# EAGLE design 8 Cell Balancing Module(2) (EAGLE 5.12)
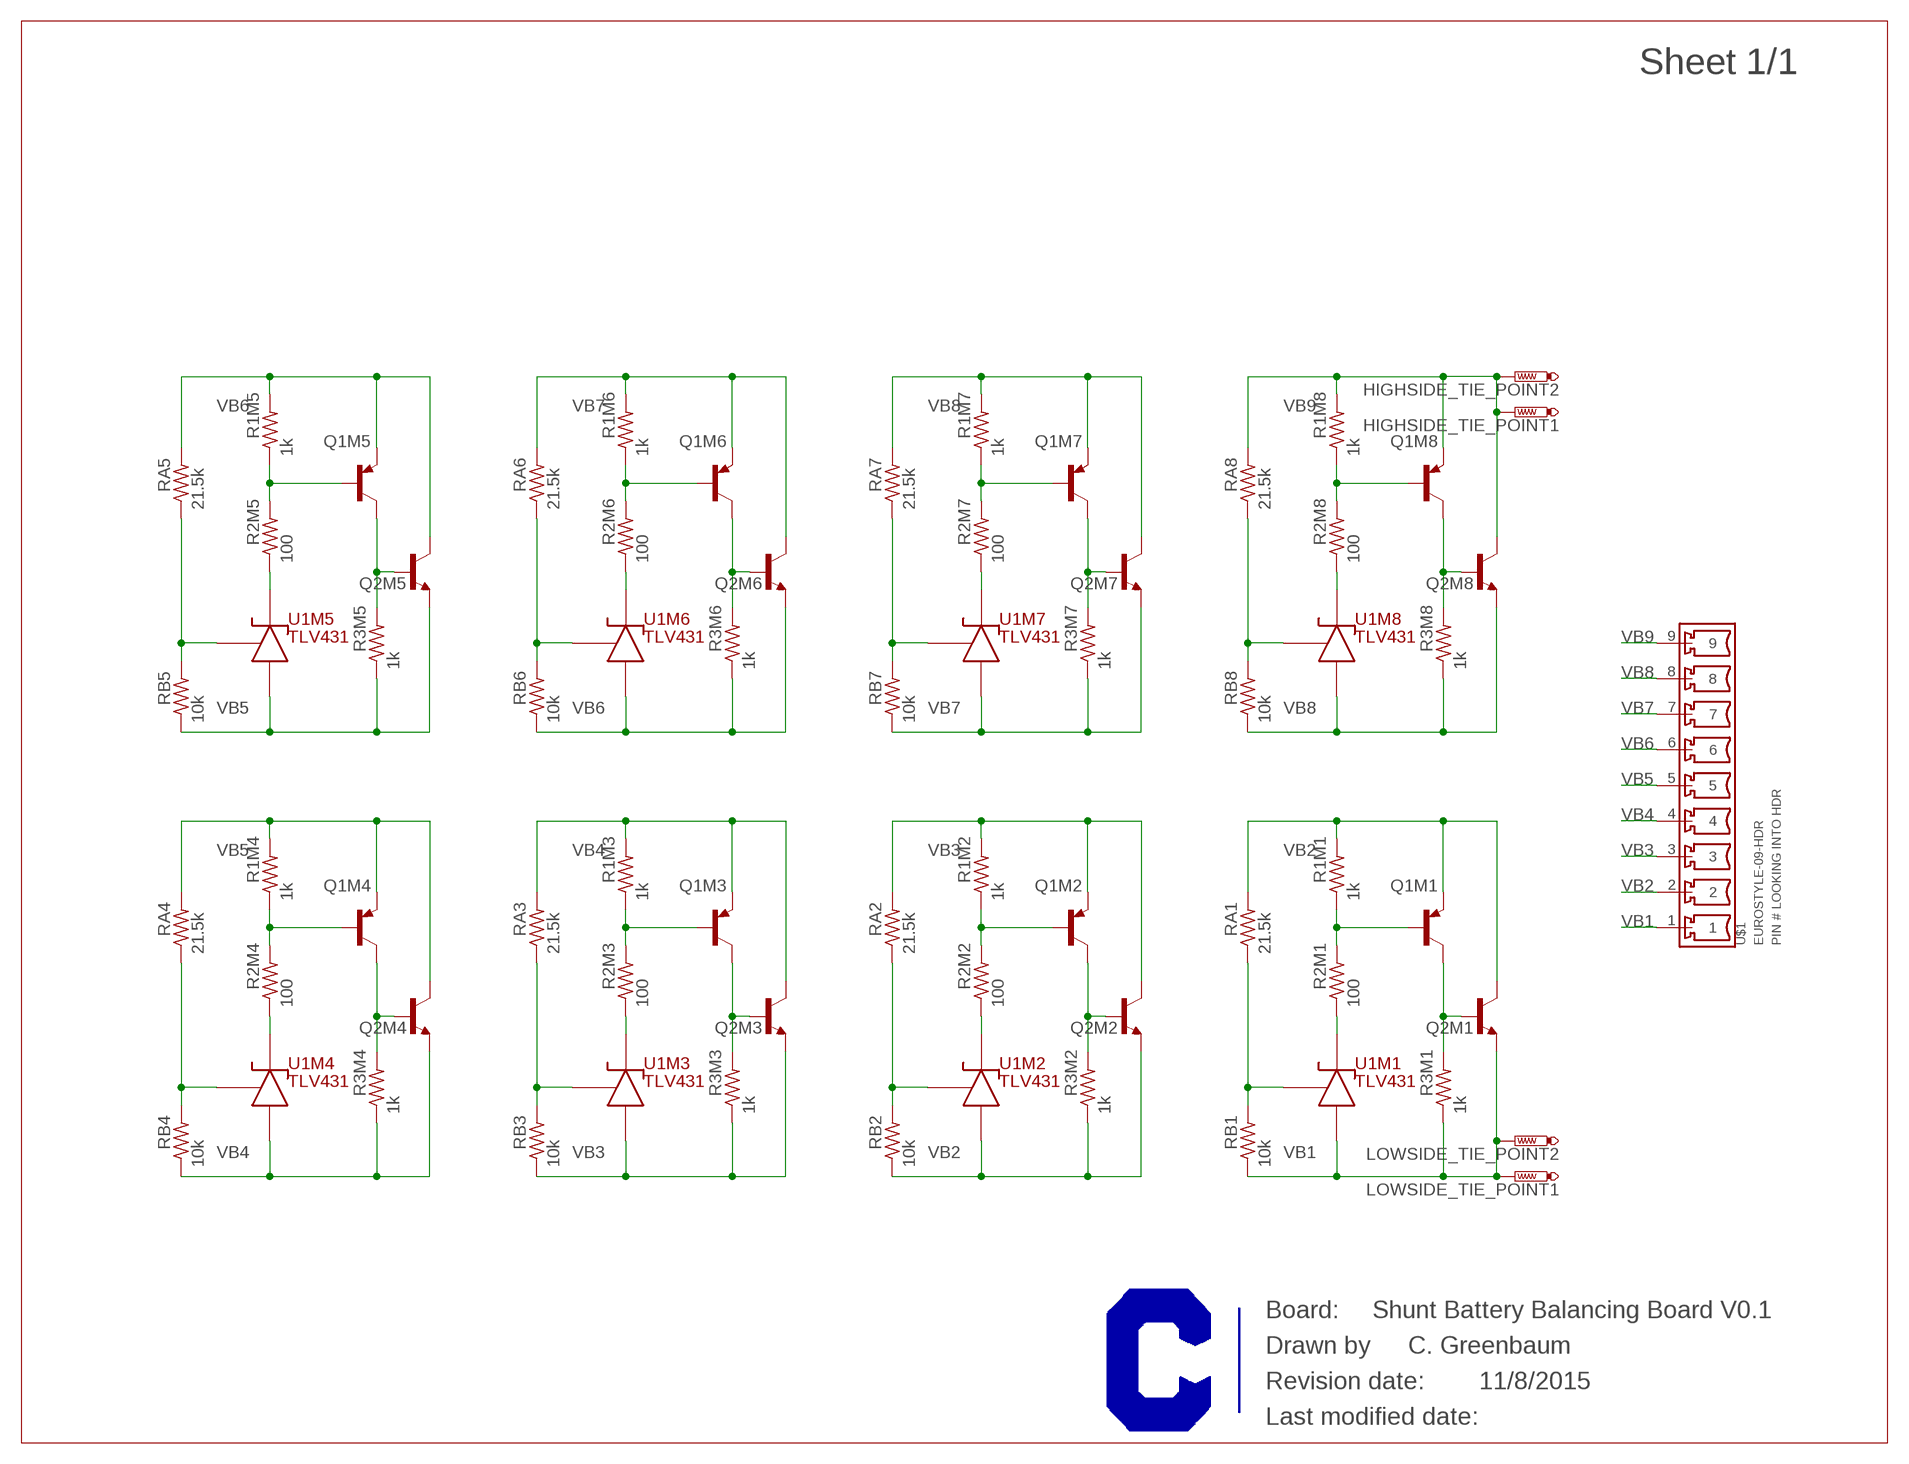
[diagram p0: schematic, sheet 1]

## Parts
HIGHSIDE_TIE_POINT1  PTR1PAD1-20Y  [P1-20Y]
HIGHSIDE_TIE_POINT2  PTR1PAD1-20Y  [P1-20Y]
LOWSIDE_TIE_POINT1  PTR1PAD1-20Y  [P1-20Y]
LOWSIDE_TIE_POINT2  PTR1PAD1-20Y  [P1-20Y]
Q1M1  MMBT3906LT1SMD  [SOT23-BEC]
Q1M2  MMBT3906LT1SMD  [SOT23-BEC]
Q1M3  MMBT3906LT1SMD  [SOT23-BEC]
Q1M4  MMBT3906LT1SMD  [SOT23-BEC]
Q1M5  MMBT3906LT1SMD  [SOT23-BEC]
Q1M6  MMBT3906LT1SMD  [SOT23-BEC]
Q1M7  MMBT3906LT1SMD  [SOT23-BEC]
Q1M8  MMBT3906LT1SMD  [SOT23-BEC]
Q2M1  D44VH10  -NPN-TO220V  [TO220V]
Q2M2  D44VH10  -NPN-TO220V  [TO220V]
Q2M3  D44VH10  -NPN-TO220V  [TO220V]
Q2M4  D44VH10  -NPN-TO220V  [TO220V]
Q2M5  D44VH10  -NPN-TO220V  [TO220V]
Q2M6  D44VH10  -NPN-TO220V  [TO220V]
Q2M7  D44VH10  -NPN-TO220V  [TO220V]
Q2M8  D44VH10  -NPN-TO220V  [TO220V]
R1M1  1k  R-US_R0603  [R0603]
R1M2  1k  R-US_R0603  [R0603]
R1M3  1k  R-US_R0603  [R0603]
R1M4  1k  R-US_R0603  [R0603]
R1M5  1k  R-US_R0603  [R0603]
R1M6  1k  R-US_R0603  [R0603]
R1M7  1k  R-US_R0603  [R0603]
R1M8  1k  R-US_R0603  [R0603]
R2M1  100  R-US_R0603  [R0603]
R2M2  100  R-US_R0603  [R0603]
R2M3  100  R-US_R0603  [R0603]
R2M4  100  R-US_R0603  [R0603]
R2M5  100  R-US_R0603  [R0603]
R2M6  100  R-US_R0603  [R0603]
R2M7  100  R-US_R0603  [R0603]
R2M8  100  R-US_R0603  [R0603]
R3M1  1k  R-US_R0603  [R0603]
R3M2  1k  R-US_R0603  [R0603]
R3M3  1k  R-US_R0603  [R0603]
R3M4  1k  R-US_R0603  [R0603]
R3M5  1k  R-US_R0603  [R0603]
R3M6  1k  R-US_R0603  [R0603]
R3M7  1k  R-US_R0603  [R0603]
R3M8  1k  R-US_R0603  [R0603]
RA1  21.5k  R-US_R0603  [R0603]
RA2  21.5k  R-US_R0603  [R0603]
RA3  21.5k  R-US_R0603  [R0603]
RA4  21.5k  R-US_R0603  [R0603]
RA5  21.5k  R-US_R0603  [R0603]
RA6  21.5k  R-US_R0603  [R0603]
RA7  21.5k  R-US_R0603  [R0603]
RA8  21.5k  R-US_R0603  [R0603]
RB1  10k  R-US_R0603  [R0603]
RB2  10k  R-US_R0603  [R0603]
RB3  10k  R-US_R0603  [R0603]
RB4  10k  R-US_R0603  [R0603]
RB5  10k  R-US_R0603  [R0603]
RB6  10k  R-US_R0603  [R0603]
RB7  10k  R-US_R0603  [R0603]
RB8  10k  R-US_R0603  [R0603]
U1M1  TLV431  [SOT-23-5_(DBV-R-PDSO-G5)]
U1M2  TLV431  [SOT-23-5_(DBV-R-PDSO-G5)]
U1M3  TLV431  [SOT-23-5_(DBV-R-PDSO-G5)]
U1M4  TLV431  [SOT-23-5_(DBV-R-PDSO-G5)]
U1M5  TLV431  [SOT-23-5_(DBV-R-PDSO-G5)]
U1M6  TLV431  [SOT-23-5_(DBV-R-PDSO-G5)]
U1M7  TLV431  [SOT-23-5_(DBV-R-PDSO-G5)]
U1M8  TLV431  [SOT-23-5_(DBV-R-PDSO-G5)]
U$1  EUROSTYLE-09-HDR  [EUROSTYLE_HEADER-9CKT-RA]

## Nets
N$1: Q1M1.C Q2M1.1(B) R3M1.2
N$2: Q1M1.B R1M1.1 R2M1.2
N$3: RA2.1 RB2.2 U1M2.4(P$2.REF)
N$4: R2M2.1 U1M2.3(P$1.CATHODE)
N$5: Q1M2.C Q2M2.1(B) R3M2.2
N$6: Q1M2.B R1M2.1 R2M2.2
N$7: RA3.1 RB3.2 U1M3.4(P$2.REF)
N$8: R2M3.1 U1M3.3(P$1.CATHODE)
N$9: Q1M3.C Q2M3.1(B) R3M3.2
N$10: Q1M3.B R1M3.1 R2M3.2
N$11: RA4.1 RB4.2 U1M4.4(P$2.REF)
N$12: R2M4.1 U1M4.3(P$1.CATHODE)
N$13: Q1M4.C Q2M4.1(B) R3M4.2
N$14: Q1M4.B R1M4.1 R2M4.2
N$15: RA5.1 RB5.2 U1M5.4(P$2.REF)
N$16: R2M5.1 U1M5.3(P$1.CATHODE)
N$17: Q1M5.C Q2M5.1(B) R3M5.2
N$18: Q1M5.B R1M5.1 R2M5.2
N$19: RA6.1 RB6.2 U1M6.4(P$2.REF)
N$20: R2M6.1 U1M6.3(P$1.CATHODE)
N$21: Q1M6.C Q2M6.1(B) R3M6.2
N$22: Q1M6.B R1M6.1 R2M6.2
N$23: RA7.1 RB7.2 U1M7.4(P$2.REF)
N$24: R2M7.1 U1M7.3(P$1.CATHODE)
N$25: Q1M7.C Q2M7.1(B) R3M7.2
N$26: Q1M7.B R1M7.1 R2M7.2
N$27: RA8.1 RB8.2 U1M8.4(P$2.REF)
N$28: R2M8.1 U1M8.3(P$1.CATHODE)
N$29: Q1M8.C Q2M8.1(B) R3M8.2
N$30: Q1M8.B R1M8.1 R2M8.2
N$50: RA1.1 RB1.2 U1M1.4(P$2.REF)
N$56: R2M1.1 U1M1.3(P$1.CATHODE)
VB1: LOWSIDE_TIE_POINT1.TP LOWSIDE_TIE_POINT2.TP Q2M1.3(E) R3M1.1 RB1.1 U1M1.5(P$3.ANODE) U$1.1
VB2: Q1M1.E Q2M1.2(C) Q2M2.3(E) R1M1.2 R3M2.1 RA1.2 RB2.1 U1M2.5(P$3.ANODE) U$1.2
VB3: Q1M2.E Q2M2.2(C) Q2M3.3(E) R1M2.2 R3M3.1 RA2.2 RB3.1 U1M3.5(P$3.ANODE) U$1.3
VB4: Q1M3.E Q2M3.2(C) Q2M4.3(E) R1M3.2 R3M4.1 RA3.2 RB4.1 U1M4.5(P$3.ANODE) U$1.4
VB5: Q1M4.E Q2M4.2(C) Q2M5.3(E) R1M4.2 R3M5.1 RA4.2 RB5.1 U1M5.5(P$3.ANODE) U$1.5
VB6: Q1M5.E Q2M5.2(C) Q2M6.3(E) R1M5.2 R3M6.1 RA5.2 RB6.1 U1M6.5(P$3.ANODE) U$1.6
VB7: Q1M6.E Q2M6.2(C) Q2M7.3(E) R1M6.2 R3M7.1 RA6.2 RB7.1 U1M7.5(P$3.ANODE) U$1.7
VB8: Q1M7.E Q2M7.2(C) Q2M8.3(E) R1M7.2 R3M8.1 RA7.2 RB8.1 U1M8.5(P$3.ANODE) U$1.8
VB9: HIGHSIDE_TIE_POINT1.TP HIGHSIDE_TIE_POINT2.TP Q1M8.E Q2M8.2(C) R1M8.2 RA8.2 U$1.9

## Notes on the sheet
- Shunt Battery Balancing Board V0.1
- C. Greenbaum
- 11/8/2015

## Library data of the parts
HIGHSIDE_TIE_POINT1 HIGHSIDE_TIE_POINT2 LOWSIDE_TIE_POINT1 LOWSIDE_TIE_POINT2 = testpad:PTR1: TEST PIN
Q1M1-Q1M8 = transistor-pnp:MMBT3906*: PNP Transistror
Q2M1-Q2M8 = transistor:*-NPN-: NPN Transistror BF959 corrected 2008.03.06
R1M1-R1M8 R2M1-R2M8 R3M1-R3M8 RA1-RA8 RB1-RB8 = resistor:R-US_: RESISTOR, American symbol
U1M1-U1M8 = TI:TLV431: TLV431 Low-Voltage Adjustable Precision Shunt Regulator TI Webpage: http://www.ti.com/product/tlv431?keyMatch=TLV431%20Low-Voltage%20Adjustable%20Precision%20Shunt%20Regulator&tisearch=Search-EN-Everything Datasheet: http://www.ti.com/lit/ds/symlink/tlv431.pdf; PARTNO: TLV431
U$1 = Molex:EUROSTYLE-09-HDR: Eurostyle (tm) 3.50mm Pitch PCB Header, 9 Circuits This is the pluggable screw terminal block that Molex makes (like on the BQ76PL536 EVM boards). Molex series number: 39502 (horizontal header), 39501 (vertical header) Mates with: 39500 horizontal plug, 39503 vertical plug Website (horizontal header): http://www.molex.com/molex/products/datasheet.jsp?part=active/0395021009_TERMINAL_BLOCKS.xml Website (vertical header): http://www.molex.com/molex/products/datasheet.jsp?part=active/0395011009_TERMINAL_BLOCKS.xml Datasheet: http://www.mouser.com/ds/2/276/0395021009_TERMINAL_BLOCKS-163866.pdf; PARTNO: 39502-1009

## Board
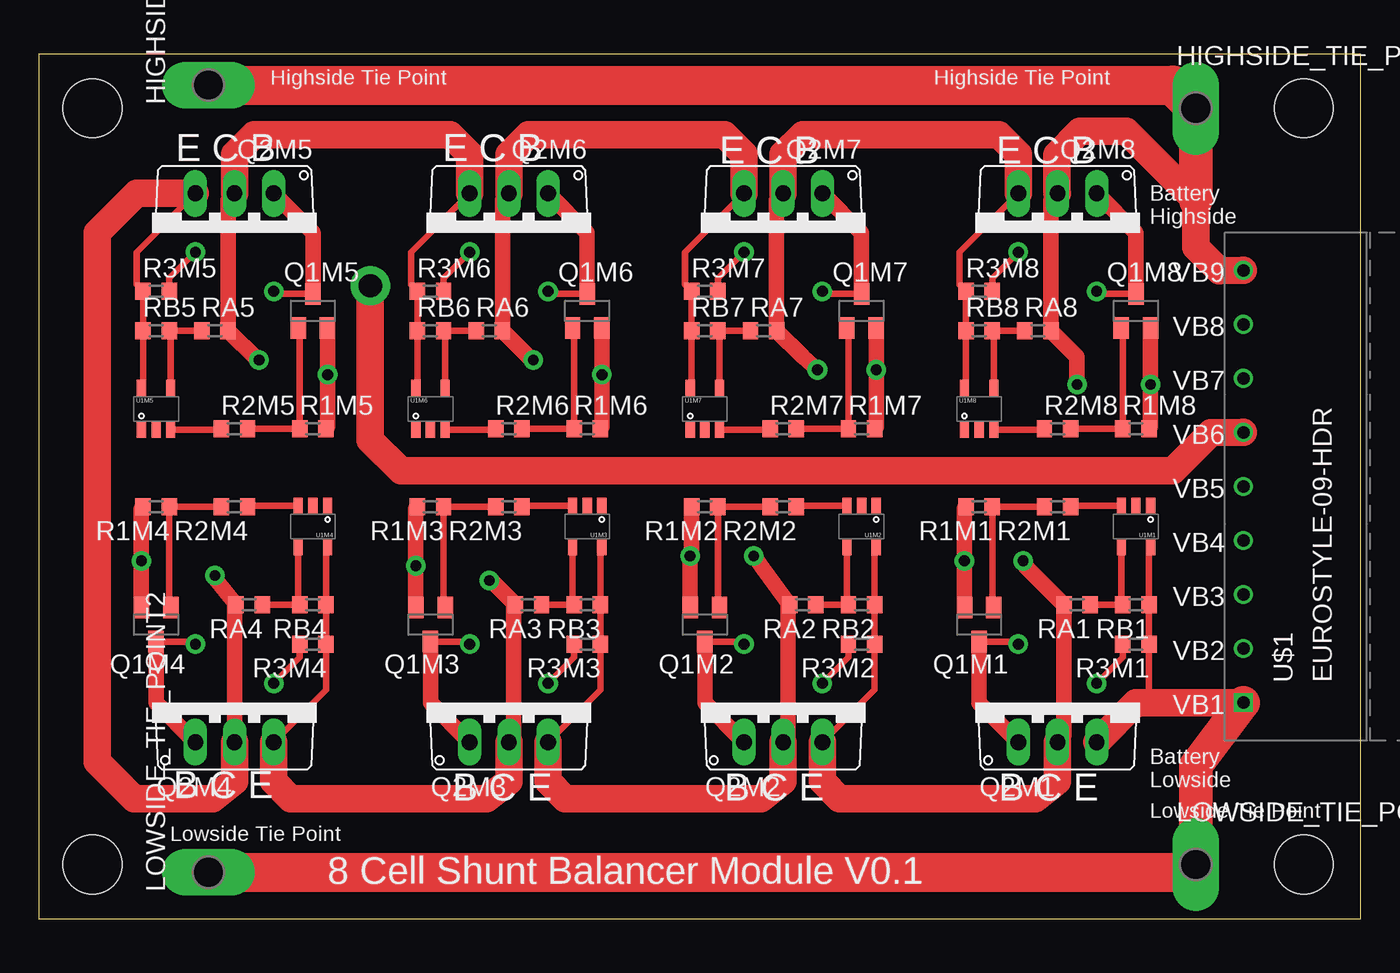
[diagram p1: board, top side]
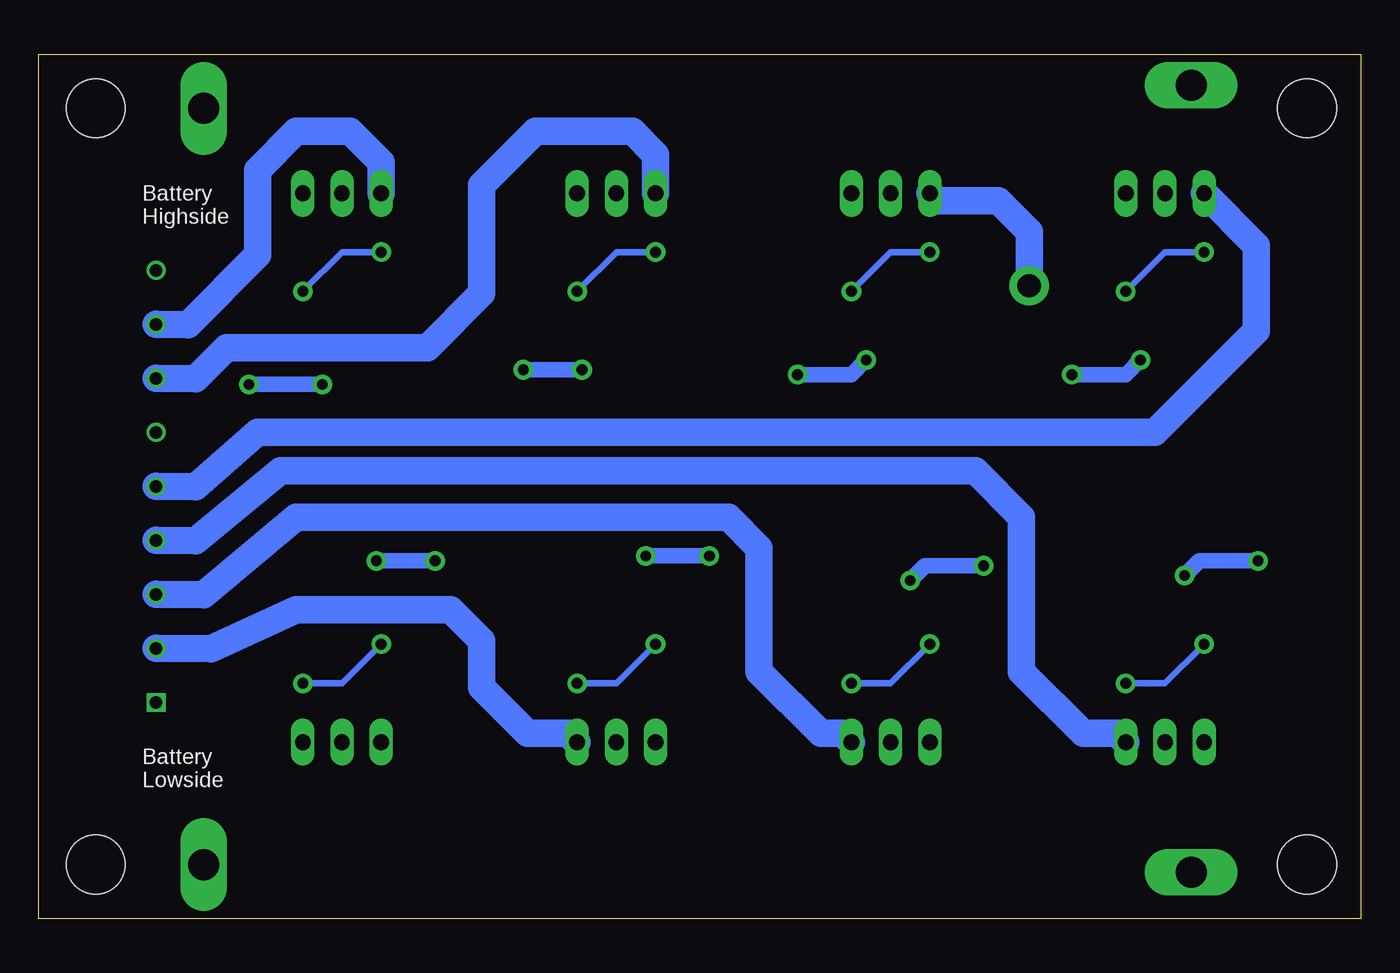
[diagram p2: board, bottom side, seen from below]

Size 85.7 x 56 mm. Coordinates in mm from the lower left corner, seen from the top.
Outline: 0,0 85.7,0 85.7,56 0,56 0,0
Copper layers (1*16): Top 0.0356mm / dielectric 1.5011mm / Bottom 0.0356mm
Design rules "OSH Park 2-layer": minimum track width 6mil, minimum drill 13mil, track to track 6mil, track to pad 6mil, pad to pad 6mil, via to via 6mil, smd to smd 6mil, copper to edge 15mil, drill to drill 6mil, minimum pad ring 7mil, minimum via ring 7mil, stop-mask expansion 4mil, vias tented up to drill 25mil, thermal gap 10mil
Holes 3.81 mm at 3.5,3.5 82,3.5 82,52.5 3.5,52.5
tKeepout: area 0.3,49.3 to 6.7,55.7; area 78.8,49.3 to 85.2,55.7; area 78.8,0.3 to 85.2,6.7; area 0.3,0.3 to 6.7,6.7
bKeepout: area 0.3,49.3 to 6.7,55.7; area 0.3,0.3 to 6.7,6.7; area 78.8,0.3 to 85.2,6.7; area 78.8,49.3 to 85.2,55.7

### Footprints (pad centres in the part's own frame; a part is rotated, then mirrored left to right if it is on the bottom)
P1-20Y = drill 2.007 pad 2.54 long: TP 0,0
SOT23-BEC = smd 1 x 1.4: B -0.95,-1.1; C 0,1.1; E 0.95,-1.1
TO220V = drill 1.016 long: 1 -2.54,-2.54; 2 0,-2.54; 3 2.54,-2.54
R0603 = smd 1 x 1.1: 1 -0.85,0; 2 0.85,0
SOT-23-5_(DBV-R-PDSO-G5) = smd 0.6 x 1.05: 1 -0.95,-1.35; 2 0,-1.35; 3 0.95,-1.35; 4 0.95,1.35; 5 -0.95,1.35
EUROSTYLE_HEADER-9CKT-RA = drill 0.8 pad 1.22 square: 1 -14,7 | drill 0.8 pad 1.22 round: 2 -10.5,7; 3 -7,7; 4 -3.5,7; 5 0,7; 6 3.5,7; 7 7,7; 8 10.5,7; 9 14,7

### Placement (x,y rotation side)
HIGHSIDE_TIE_POINT1  75,52.5 0 top
HIGHSIDE_TIE_POINT2  11,54 90 top
LOWSIDE_TIE_POINT1  75,3.5 0 top
LOWSIDE_TIE_POINT2  11,3 90 top
Q1M1  60.96,19.05 180 top
Q1M2  43.18,19.05 180 top
Q1M3  25.4,19.05 180 top
Q1M4  7.62,19.05 180 top
Q1M5  17.78,39.37 0 top
Q1M6  35.56,39.37 0 top
Q1M7  53.34,39.37 0 top
Q1M8  71.12,39.37 0 top
Q2M1  66.04,13.97 0 top
Q2M2  48.26,13.97 0 top
Q2M3  30.48,13.97 0 top
Q2M4  12.7,13.97 0 top
Q2M5  12.7,44.45 180 top
Q2M6  30.48,44.45 180 top
Q2M7  48.26,44.45 180 top
Q2M8  66.04,44.45 180 top
R1M1  60.96,26.67 180 top
R1M2  43.18,26.67 180 top
R1M3  25.4,26.67 180 top
R1M4  7.62,26.67 180 top
R1M5  17.78,31.75 0 top
R1M6  35.56,31.75 0 top
R1M7  53.34,31.75 0 top
R1M8  71.12,31.75 0 top
R2M1  66.04,26.67 180 top
R2M2  48.26,26.67 180 top
R2M3  30.48,26.67 180 top
R2M4  12.7,26.67 180 top
R2M5  12.7,31.75 0 top
R2M6  30.48,31.75 0 top
R2M7  48.26,31.75 0 top
R2M8  66.04,31.75 0 top
R3M1  71.12,17.78 180 top
R3M2  53.34,17.78 180 top
R3M3  35.56,17.78 180 top
R3M4  17.78,17.78 180 top
R3M5  7.62,40.64 0 top
R3M6  25.4,40.64 0 top
R3M7  43.18,40.64 0 top
R3M8  60.96,40.64 0 top
RA1  67.31,20.32 180 top
RA2  49.53,20.32 180 top
RA3  31.75,20.32 180 top
RA4  13.65,20.32 180 top
RA5  11.43,38.1 0 top
RA6  29.21,38.1 0 top
RA7  46.99,38.1 0 top
RA8  64.77,38.1 0 top
RB1  71.12,20.32 180 top
RB2  53.34,20.32 180 top
RB3  35.56,20.32 180 top
RB4  17.78,20.32 180 top
RB5  7.62,38.1 0 top
RB6  25.4,38.1 0 top
RB7  43.18,38.1 0 top
RB8  60.96,38.1 0 top
U1M1  71.12,25.4 180 top
U1M2  53.34,25.4 180 top
U1M3  35.56,25.4 180 top
U1M4  17.78,25.4 180 top
U1M5  7.62,33.02 0 top
U1M6  25.4,33.02 0 top
U1M7  43.18,33.02 0 top
U1M8  60.96,33.02 0 top
U$1  85.09,28 90 top

### Tracks (layer width: path | path; a pad name or v marks a point on that pad's centre or on a via)
N$1  (via drill 0.7 pad 1.27)
  Top 0.406: R3M1.2 70.27,16.93 v68.58,15.24 | v63.5,17.78 63.33,17.95 Q1M1.C
  Top 1.016: Q2M1.1 60.96,13.97 Q1M1.C
  Bottom 0.406: v68.58,15.24 66.04,15.24 v63.5,17.78
N$2
  Top 0.406: R1M1.1 R2M1.2 | R1M1.1 61.91,26.67 | Q1M1.B 61.81,20.25 R1M1.1
N$3
  Top 0.406: U1M2.4 52.39,20.32 RB2.2 RA2.1
N$4
  Top 0.406: U1M2.3 49.11,26.75 R2M2.1
N$5  (via drill 0.7 pad 1.27)
  Top 0.406: R3M2.2 52.49,16.93 v50.8,15.24 | v45.72,17.78 45.55,17.95 Q1M2.C
  Top 1.016: Q2M2.1 43.18,13.97 Q1M2.C
  Bottom 0.406: v50.8,15.24 48.26,15.24 v45.72,17.78
N$6
  Top 0.406: R1M2.1 R2M2.2 | R1M2.1 44.13,26.67 | Q1M2.B 44.03,20.25 R1M2.1
N$7
  Top 0.406: U1M3.4 34.61,20.32 RB3.2 RA3.1
N$8
  Top 0.406: U1M3.3 31.33,26.75 R2M3.1
N$9  (via drill 0.7 pad 1.27)
  Top 0.406: R3M3.2 34.71,16.93 v33.02,15.24 | v27.94,17.78 27.77,17.95 Q1M3.C
  Top 1.016: Q2M3.1 25.4,13.97 Q1M3.C
  Bottom 0.406: v33.02,15.24 30.48,15.24 v27.94,17.78
N$10
  Top 0.406: R1M3.1 R2M3.2 | R1M3.1 26.35,26.67 | Q1M3.B 26.25,20.25 R1M3.1
N$11
  Top 0.406: U1M4.4 16.83,20.32 RB4.2 RA4.1
N$12
  Top 0.406: U1M4.3 13.55,26.75 R2M4.1
N$13  (via drill 0.7 pad 1.27)
  Top 0.406: R3M4.2 16.93,16.93 v15.24,15.24 | v10.16,17.78 9.99,17.95 Q1M4.C
  Top 1.016: Q2M4.1 7.62,13.97 Q1M4.C
  Bottom 0.406: v15.24,15.24 12.7,15.24 v10.16,17.78
N$14
  Top 0.406: R1M4.1 R2M4.2 | R1M4.1 8.57,26.67 | Q1M4.B 8.47,20.25 R1M4.1
N$15
  Top 0.406: U1M5.4 8.57,38.1 RB5.2 RA5.1
N$16
  Top 0.406: U1M5.3 11.85,31.67 R2M5.1
N$17  (via drill 0.7 pad 1.27)
  Top 0.406: R3M5.2 8.47,41.49 v10.16,43.18 | v15.24,40.64 15.41,40.47 Q1M5.C
  Top 1.016: Q2M5.1 17.78,44.45 Q1M5.C
  Bottom 0.406: v10.16,43.18 12.7,43.18 v15.24,40.64
N$18
  Top 0.406: R2M5.2 R1M5.1 | R1M5.1 16.83,31.75 | Q1M5.B 16.93,38.17 R1M5.1
N$19
  Top 0.406: U1M6.4 26.35,38.1 RB6.2 RA6.1
N$20
  Top 0.406: U1M6.3 29.63,31.67 R2M6.1
N$21  (via drill 0.7 pad 1.27)
  Top 0.406: R3M6.2 26.25,41.49 v27.94,43.18 | v33.02,40.64 33.19,40.47 Q1M6.C
  Top 1.016: Q2M6.1 35.56,44.45 Q1M6.C
  Bottom 0.406: v27.94,43.18 30.48,43.18 v33.02,40.64
N$22
  Top 0.406: R2M6.2 R1M6.1 | R1M6.1 34.61,31.75 | Q1M6.B 34.71,38.17 R1M6.1
N$23
  Top 0.406: U1M7.4 44.13,38.1 RB7.2 RA7.1
N$24
  Top 0.406: U1M7.3 47.41,31.67 R2M7.1
N$25  (via drill 0.7 pad 1.27)
  Top 0.406: R3M7.2 44.03,41.49 v45.72,43.18 | v50.8,40.64 50.97,40.47 Q1M7.C
  Top 1.016: Q2M7.1 53.34,44.45 Q1M7.C
  Bottom 0.406: v45.72,43.18 48.26,43.18 v50.8,40.64
N$26
  Top 0.406: R2M7.2 R1M7.1 | R1M7.1 52.39,31.75 | Q1M7.B 52.49,38.17 R1M7.1
N$27
  Top 0.406: U1M8.4 61.91,38.1 RB8.2 RA8.1
N$28
  Top 0.406: U1M8.3 65.19,31.67 R2M8.1
N$29  (via drill 0.7 pad 1.27)
  Top 0.406: R3M8.2 61.81,41.49 v63.5,43.18 | v68.58,40.64 68.75,40.47 Q1M8.C
  Top 1.016: Q2M8.1 71.12,44.45 Q1M8.C
  Bottom 0.406: v63.5,43.18 66.04,43.18 v68.58,40.64
N$30
  Top 0.406: R2M8.2 R1M8.1 | R1M8.1 70.17,31.75 | Q1M8.B 70.27,38.17 R1M8.1
N$50
  Top 0.406: U1M1.4 70.17,20.32 RB1.2 RA1.1
N$56
  Top 0.406: U1M1.3 66.89,26.75 R2M1.1
VB1
  Top 0.406: U1M1.5 71.97,24.05 RB1.1 R3M1.1 71.97,14.82 71.13,13.98
  Top 1.778: U$1.1 71.13,13.98 Q2M1.3
  Top 2.184: LOWSIDE_TIE_POINT1.TP 75,9.89 U$1.1
  Top 2.54: LOWSIDE_TIE_POINT2.TP 74.5,3 LOWSIDE_TIE_POINT1.TP
VB2  (via drill 0.7 pad 1.27)
  Top 0.406: U1M2.5 54.19,24.05 RB2.1 R3M2.1 54.19,14.82 Q2M2.3
  Top 1.016: Q2M1.2 66.46,11.85 RA1.2 63.92,22.86 v63.82,23.18 | 60.01,22.86 Q1M1.E | v60.01,23.18 60.01,22.86 | 60.01,22.86 60.01,26.57 R1M1.2
  Top 1.778: Q2M1.2 66.04,8.89 64.61,7.78 51.91,7.78 50.8,8.89 Q2M2.3
  Bottom 1.016: v63.82,23.18 v60.01,23.18
  Bottom 1.778: U$1.2 74.52,17.48 69,20 59,20 57,18 57,15 54,12 51.37,12 Q2M2.3
VB3  (via drill 0.7 pad 1.27)
  Top 0.406: U1M3.5 36.41,24.05 RB3.1 R3M3.1 36.41,14.82 Q2M3.3
  Top 1.016: Q1M2.E v42.23,23.49 v42.23,23.5 42.33,23.6 R1M2.2 | v46.35,23.5 46.99,22.64 RA2.2 48.58,20.22 48.58,11.75 Q2M2.2
  Top 1.778: Q2M2.2 48.26,8.89 46.83,7.78 34.13,7.78 33.02,8.89 Q2M3.3
  Bottom 1.016: v46.35,23.5 v42.23,23.5
  Bottom 1.778: U$1.3 75.02,20.98 69,26 41,26 39,24 39,16 35,12 33.59,12 Q2M3.3
VB4  (via drill 0.7 pad 1.27)
  Top 0.406: U1M4.5 18.63,24.05 RB4.1 R3M4.1 18.63,14.82 Q2M4.3
  Top 1.016: Q1M3.E v24.45,22.86 24.45,26.57 R1M3.2 | v29.21,21.91 29.31,21.91 RA3.2 30.8,20.22 30.8,11.75 Q2M3.2
  Top 1.778: Q2M3.2 30.48,8.89 29.05,7.78 16.35,7.78 15.24,8.89 Q2M4.3
  Bottom 1.016: v24.45,22.86 28.26,22.86 v29.21,21.91
  Bottom 1.778: U$1.4 75.52,24.48 70,29 25,29 22,26 22,16 18,12 15.81,12 Q2M4.3
VB5  (via drill 0.7 pad 1.27)
  Top 0.406: U1M5.5 6.77,34.37 RB5.1 R3M5.1 6.35,41.06 6.35,43.18 Q2M5.3
  Top 1.016: Q1M4.E v6.67,23.18 6.67,26.57 R1M4.2 | v11.43,22.23 11.43,22.01 RA4.2 12.7,20.22 Q2M4.2
  Top 1.778: Q2M4.2 12.7,8.89 11.27,7.78 6.19,7.78 3.81,10.16 3.81,44.45 6.35,46.99 Q2M5.3
  Bottom 1.016: v6.67,23.18 10.48,23.18 v11.43,22.23
  Bottom 1.778: U$1.5 75.52,27.98 71.5,31.5 13.37,31.5 RB5.1 6.77,43.6 Q2M5.3
VB6  (via drill 0.7 pad 1.27, 1.5 pad 2.54)
  Top 0.406: U1M6.5 24.55,34.37 RB6.1 R3M6.1 24.13,41.06 24.13,43.18 Q2M6.3
  Top 1.016: Q2M5.2 12.28,46.57 RA5.2 14.19,36.2 v14.29,36.2 | v18.73,35.24 Q1M5.E | v18.73,35.24 | v18.73,35.24 18.73,31.85 R1M5.2
  Top 1.778: Q2M5.2 12.7,49.53 13.97,50.8 26.67,50.8 27.94,49.53 Q2M6.3 | U$1.6 75.98,31.48 73.5,29 23.5,29 21.5,31 v21.5,41
  Bottom 1.016: v18.73,35.24 15.24,35.24 v14.29,36.2
  Bottom 1.778: v21.5,41 21.5,44.5 23.5,46.5 27.45,46.5 Q2M6.3
VB7  (via drill 0.7 pad 1.27)
  Top 0.406: U1M7.5 42.33,34.37 RB7.1 R3M7.1 41.91,41.06 41.91,43.18 Q2M7.3
  Top 1.016: Q2M6.2 30.06,46.57 RA6.2 31.96,36.2 v32.07,36.2 | v36.51,35.24 Q1M6.E | v36.51,35.24 | v36.51,35.24 36.51,31.85 R1M6.2
  Top 1.778: Q2M6.2 30.48,49.53 31.75,50.8 44.45,50.8 45.72,49.53 Q2M7.3
  Bottom 1.016: v36.51,35.24 33.02,35.24 v32.07,36.2
  Bottom 1.778: U$1.7 75.52,34.98 73.5,37 60.5,37 57,40.5 57,47.5 53.5,51 47.22,51 45.72,49.5 Q2M7.3
VB8  (via drill 0.7 pad 1.27)
  Top 0.406: U1M8.5 60.11,34.37 RB8.1 R3M8.1 59.69,41.06 59.69,43.18 Q2M8.3
  Top 1.016: Q2M7.2 47.84,46.57 RA7.2 49.53,36.41 v50.48,35.56 | v54.29,35.56 Q1M7.E | v54.29,35.56 | v54.29,35.56 54.29,31.85 R1M7.2
  Top 1.778: Q2M7.2 48.26,49.53 49.53,50.8 62.23,50.8 63.5,49.53 Q2M8.3
  Bottom 1.016: v54.29,35.56 v50.48,35.56
  Bottom 1.778: U$1.8 76.02,38.48 71.5,43 71.5,48.5 69,51 65.5,51 63.5,49 Q2M8.3
VB9  (via drill 0.7 pad 1.27)
  Top 1.016: Q2M8.2 65.62,46.57 RA8.2 67.31,36.41 v67.31,34.61 | 72.07,35.24 Q1M8.E | v72.07,34.61 72.07,35.24 | 72.07,35.24 72.07,31.85 R1M8.2
  Top 1.778: U$1.9 76.52,41.98 75,43.5 75,46.5 70.5,51 67.5,51 66,49.5 66,47.03 Q2M8.2
  Top 2.184: HIGHSIDE_TIE_POINT1.TP 75,46.5
  Top 2.54: HIGHSIDE_TIE_POINT2.TP 73.5,54 HIGHSIDE_TIE_POINT1.TP
  Bottom 1.016: v67.31,34.61 v72.07,34.61

### Text on the board
tPlace: Highside Tie Point | Highside Tie Point | E C B | E C B | E C B | E C B | E C B | E C B | Battery | Highside | VB9 | VB8 | VB7 | VB6 | VB5 | VB4 | VB3 | VB2 | VB1 | Battery | B C E | B C E | B C E | B C E | Lowside | Lowside Tie Point | Lowside Tie Point | 8 Cell Shunt Balancer Module V0.1
bPlace: Battery | Highside | Battery | Lowside